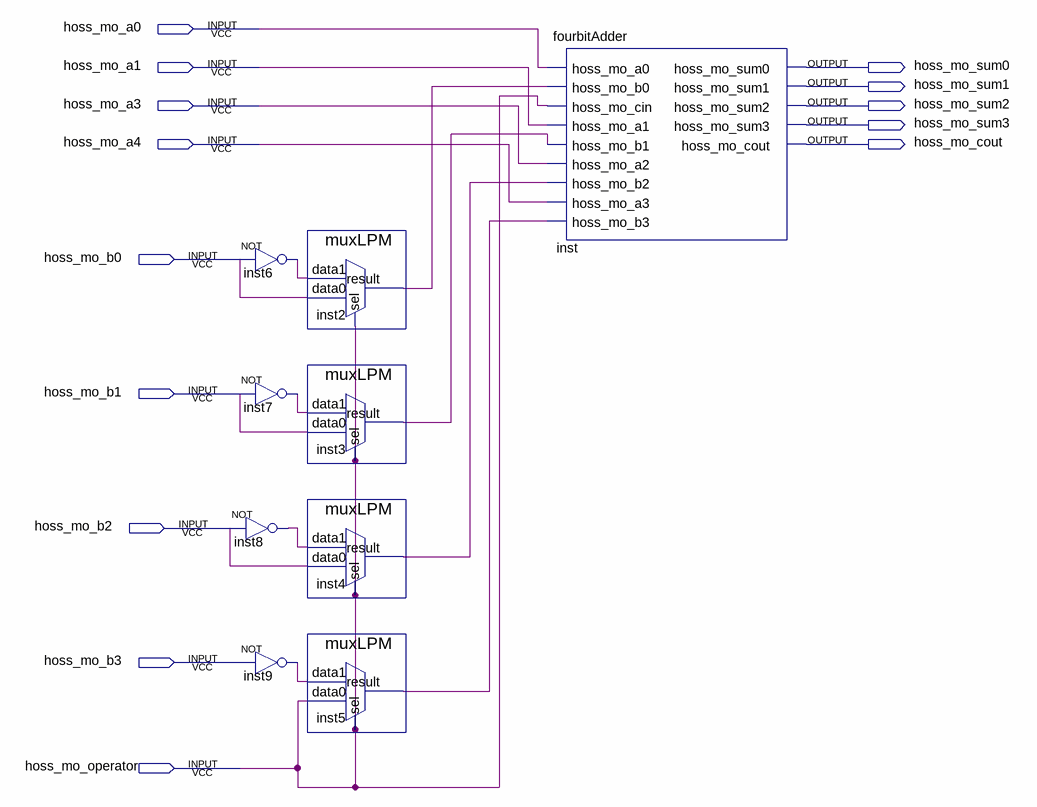
[diagram p0: schematic sheet]
// Quartus schematic adderSubtracterWmuxLPM.bdf as structural Verilog: 9 symbols, 14 pins
module adderSubtracterWmuxLPM (
  input  hoss_mo_a0,
  input  hoss_mo_a1,
  input  hoss_mo_a3,
  input  hoss_mo_a4,
  input  hoss_mo_b0,
  input  hoss_mo_b1,
  input  hoss_mo_b2,
  input  hoss_mo_b3,
  input  hoss_mo_operator,
  output hoss_mo_sum0,
  output hoss_mo_sum1,
  output hoss_mo_sum2,
  output hoss_mo_sum3,
  output hoss_mo_cout
);

  wire inst2_result, inst3_result, inst4_result, inst5_result, inst6_out, inst7_out, inst8_out, inst9_out;

  not inst6 (inst6_out, hoss_mo_b0);
  not inst7 (inst7_out, hoss_mo_b1);
  not inst8 (inst8_out, hoss_mo_b2);
  not inst9 (inst9_out, hoss_mo_b3);
  muxLPM inst2 (.data1(inst6_out), .data0(hoss_mo_b0), .sel(hoss_mo_operator), .result(inst2_result));
  muxLPM inst3 (.data1(inst7_out), .data0(hoss_mo_b1), .sel(hoss_mo_operator), .result(inst3_result));
  muxLPM inst4 (.data1(inst8_out), .data0(hoss_mo_b2), .sel(hoss_mo_operator), .result(inst4_result));
  muxLPM inst5 (.data1(inst9_out), .data0(hoss_mo_operator), .sel(hoss_mo_operator), .result(inst5_result));
  fourbitAdder inst (
    .hoss_mo_a0(hoss_mo_a0), .hoss_mo_b0(inst2_result), .hoss_mo_cin(hoss_mo_operator),
    .hoss_mo_a1(hoss_mo_a1), .hoss_mo_b1(inst3_result), .hoss_mo_a2(hoss_mo_a3), .hoss_mo_b2(inst4_result),
    .hoss_mo_a3(hoss_mo_a4), .hoss_mo_b3(inst5_result), .hoss_mo_sum0(hoss_mo_sum0),
    .hoss_mo_sum1(hoss_mo_sum1), .hoss_mo_sum2(hoss_mo_sum2), .hoss_mo_sum3(hoss_mo_sum3),
    .hoss_mo_cout(hoss_mo_cout));
endmodule
